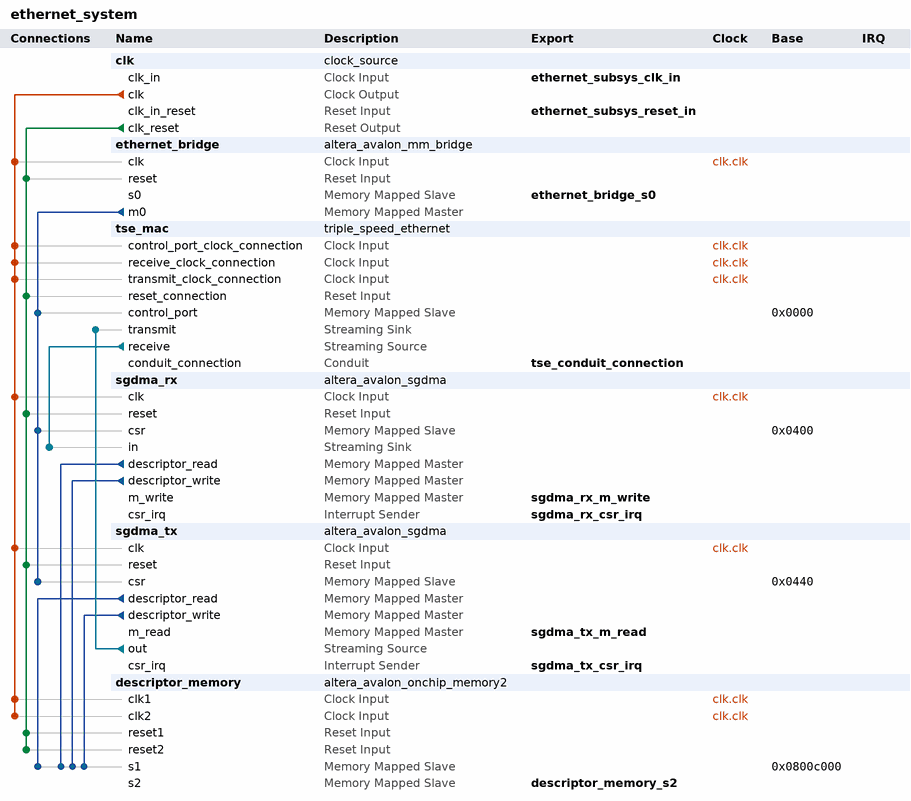
[diagram p0: system contents]
# Platform Designer (Qsys) system ethernet_system
# Parameters at their usual value, and those the tool derives, are not listed.
package require -exact qsys 11.0
create_system ethernet_system
set_project_property DEVICE_FAMILY CYCLONEIII

add_instance clk clock_source 11.0
set_instance_parameter_value clk clockFrequency 62500000

add_instance ethernet_bridge altera_avalon_mm_bridge 11.0
set_instance_parameter_value ethernet_bridge DATA_WIDTH 32
set_instance_parameter_value ethernet_bridge ADDRESS_WIDTH 11
set_instance_parameter_value ethernet_bridge ADDRESS_UNITS SYMBOLS
set_instance_parameter_value ethernet_bridge MAX_PENDING_RESPONSES 4

add_instance tse_mac triple_speed_ethernet 11.0
set_instance_parameter_value tse_mac atlanticSinkClockRate 0
set_instance_parameter_value tse_mac atlanticSinkClockSource unassigned
set_instance_parameter_value tse_mac atlanticSourceClockRate 0
set_instance_parameter_value tse_mac atlanticSourceClockSource unassigned
set_instance_parameter_value tse_mac avalonSlaveClockRate 0
set_instance_parameter_value tse_mac avalonSlaveClockSource unassigned
set_instance_parameter_value tse_mac avalonStNeighbours {unassigned=unassigned}
set_instance_parameter_value tse_mac channel_count 1
set_instance_parameter_value tse_mac core_variation MAC_ONLY
set_instance_parameter_value tse_mac core_version 2816
set_instance_parameter_value tse_mac crc32check16bit 0
set_instance_parameter_value tse_mac crc32dwidth 8
set_instance_parameter_value tse_mac crc32gendelay 6
set_instance_parameter_value tse_mac crc32s1l2_extern false
set_instance_parameter_value tse_mac cust_version 0
set_instance_parameter_value tse_mac dataBitsPerSymbol 8
set_instance_parameter_value tse_mac dev_version 2816
set_instance_parameter_value tse_mac eg_addr 11
set_instance_parameter_value tse_mac ena_hash false
set_instance_parameter_value tse_mac enable_alt_reconfig false
set_instance_parameter_value tse_mac enable_clk_sharing false
set_instance_parameter_value tse_mac enable_ena 32
set_instance_parameter_value tse_mac enable_fifoless false
set_instance_parameter_value tse_mac enable_gmii_loopback false
set_instance_parameter_value tse_mac enable_hd_logic true
set_instance_parameter_value tse_mac enable_mac_flow_ctrl true
set_instance_parameter_value tse_mac enable_mac_txaddr_set true
set_instance_parameter_value tse_mac enable_mac_vlan false
set_instance_parameter_value tse_mac enable_maclite false
set_instance_parameter_value tse_mac enable_magic_detect false
set_instance_parameter_value tse_mac enable_multi_channel false
set_instance_parameter_value tse_mac enable_pkt_class true
set_instance_parameter_value tse_mac enable_pma false
set_instance_parameter_value tse_mac enable_reg_sharing false
set_instance_parameter_value tse_mac enable_sgmii false
set_instance_parameter_value tse_mac enable_shift16 true
set_instance_parameter_value tse_mac enable_sup_addr false
set_instance_parameter_value tse_mac enable_use_internal_fifo true
set_instance_parameter_value tse_mac export_calblkclk false
set_instance_parameter_value tse_mac export_pwrdn false
set_instance_parameter_value tse_mac ext_stat_cnt_ena false
set_instance_parameter_value tse_mac gigeAdvanceMode true
set_instance_parameter_value tse_mac ifGMII RGMII
set_instance_parameter_value tse_mac ifPCSuseEmbeddedSerdes false
set_instance_parameter_value tse_mac ing_addr 11
set_instance_parameter_value tse_mac insert_ta true
set_instance_parameter_value tse_mac maclite_gige false
set_instance_parameter_value tse_mac max_channels 1
set_instance_parameter_value tse_mac mdio_clk_div 30
set_instance_parameter_value tse_mac phy_identifier 0
set_instance_parameter_value tse_mac ramType AUTO
set_instance_parameter_value tse_mac reset_level 1
set_instance_parameter_value tse_mac starting_channel_number 0
set_instance_parameter_value tse_mac stat_cnt_ena true
set_instance_parameter_value tse_mac timingAdapterName timingAdapter
set_instance_parameter_value tse_mac toolContext SOPC_BUILDER
set_instance_parameter_value tse_mac transceiver_type GXB
set_instance_parameter_value tse_mac uiHostClockFrequency 0
set_instance_parameter_value tse_mac uiMDIOFreq {0.0 MHz}
set_instance_parameter_value tse_mac useLvds false
set_instance_parameter_value tse_mac useMAC true
set_instance_parameter_value tse_mac useMDIO true
set_instance_parameter_value tse_mac usePCS false
set_instance_parameter_value tse_mac use_sync_reset true

add_instance sgdma_rx altera_avalon_sgdma 11.0
set_instance_parameter_value sgdma_rx enableBurstTransfers false
set_instance_parameter_value sgdma_rx enableUnalignedTransfers false
set_instance_parameter_value sgdma_rx readBlockDataWidth 32
set_instance_parameter_value sgdma_rx sinkErrorWidth 6
set_instance_parameter_value sgdma_rx sourceErrorWidth 0
set_instance_parameter_value sgdma_rx transferMode STREAM_TO_MEMORY
set_instance_parameter_value sgdma_rx writeBurstcountWidth 4

add_instance sgdma_tx altera_avalon_sgdma 11.0
set_instance_parameter_value sgdma_tx enableBurstTransfers false
set_instance_parameter_value sgdma_tx enableUnalignedTransfers false
set_instance_parameter_value sgdma_tx readBlockDataWidth 32
set_instance_parameter_value sgdma_tx sinkErrorWidth 0
set_instance_parameter_value sgdma_tx sourceErrorWidth 1
set_instance_parameter_value sgdma_tx transferMode MEMORY_TO_STREAM
set_instance_parameter_value sgdma_tx writeBurstcountWidth 4

add_instance descriptor_memory altera_avalon_onchip_memory2 11.0
set_instance_parameter_value descriptor_memory dataWidth 32
set_instance_parameter_value descriptor_memory dualPort true
set_instance_parameter_value descriptor_memory initMemContent true
set_instance_parameter_value descriptor_memory initializationFileName descriptor_memory
set_instance_parameter_value descriptor_memory memorySize 8192

# connections
add_connection clk.clk descriptor_memory.clk1 clock
add_connection clk.clk descriptor_memory.clk2 clock
add_connection clk.clk ethernet_bridge.clk clock
add_connection clk.clk sgdma_rx.clk clock
add_connection clk.clk sgdma_tx.clk clock
add_connection clk.clk tse_mac.control_port_clock_connection clock
add_connection clk.clk tse_mac.receive_clock_connection clock
add_connection clk.clk tse_mac.transmit_clock_connection clock
add_connection clk.clk_reset descriptor_memory.reset1 reset
add_connection clk.clk_reset descriptor_memory.reset2 reset
add_connection clk.clk_reset ethernet_bridge.reset reset
add_connection clk.clk_reset sgdma_rx.reset reset
add_connection clk.clk_reset sgdma_tx.reset reset
add_connection clk.clk_reset tse_mac.reset_connection reset
add_connection ethernet_bridge.m0 sgdma_rx.csr avalon
set_connection_parameter_value ethernet_bridge.m0/sgdma_rx.csr baseAddress 0x0400
add_connection ethernet_bridge.m0 sgdma_tx.csr avalon
set_connection_parameter_value ethernet_bridge.m0/sgdma_tx.csr baseAddress 0x0440
add_connection ethernet_bridge.m0 tse_mac.control_port avalon
set_connection_parameter_value ethernet_bridge.m0/tse_mac.control_port baseAddress 0x0000
add_connection sgdma_rx.descriptor_read descriptor_memory.s1 avalon
set_connection_parameter_value sgdma_rx.descriptor_read/descriptor_memory.s1 baseAddress 0x0800c000
add_connection sgdma_rx.descriptor_write descriptor_memory.s1 avalon
set_connection_parameter_value sgdma_rx.descriptor_write/descriptor_memory.s1 baseAddress 0x0800c000
add_connection sgdma_tx.descriptor_read descriptor_memory.s1 avalon
set_connection_parameter_value sgdma_tx.descriptor_read/descriptor_memory.s1 baseAddress 0x0800c000
add_connection sgdma_tx.descriptor_write descriptor_memory.s1 avalon
set_connection_parameter_value sgdma_tx.descriptor_write/descriptor_memory.s1 baseAddress 0x0800c000
add_connection sgdma_tx.out tse_mac.transmit avalon_streaming
add_connection tse_mac.receive sgdma_rx.in avalon_streaming

# exported interfaces
add_interface ethernet_subsys_clk_in clock sink
set_interface_property ethernet_subsys_clk_in EXPORT_OF clk.clk_in
add_interface ethernet_subsys_reset_in reset sink
set_interface_property ethernet_subsys_reset_in EXPORT_OF clk.clk_in_reset
add_interface ethernet_bridge_s0 avalon slave
set_interface_property ethernet_bridge_s0 EXPORT_OF ethernet_bridge.s0
add_interface tse_conduit_connection conduit end
set_interface_property tse_conduit_connection EXPORT_OF tse_mac.conduit_connection
add_interface sgdma_rx_csr_irq interrupt sender
set_interface_property sgdma_rx_csr_irq EXPORT_OF sgdma_rx.csr_irq
add_interface sgdma_rx_m_write avalon master
set_interface_property sgdma_rx_m_write EXPORT_OF sgdma_rx.m_write
add_interface sgdma_tx_csr_irq interrupt sender
set_interface_property sgdma_tx_csr_irq EXPORT_OF sgdma_tx.csr_irq
add_interface sgdma_tx_m_read avalon master
set_interface_property sgdma_tx_m_read EXPORT_OF sgdma_tx.m_read
add_interface descriptor_memory_s2 avalon slave
set_interface_property descriptor_memory_s2 EXPORT_OF descriptor_memory.s2

save_system ethernet_system.qsys
